# EAGLE design GPS lure (EAGLE 7.6.0)
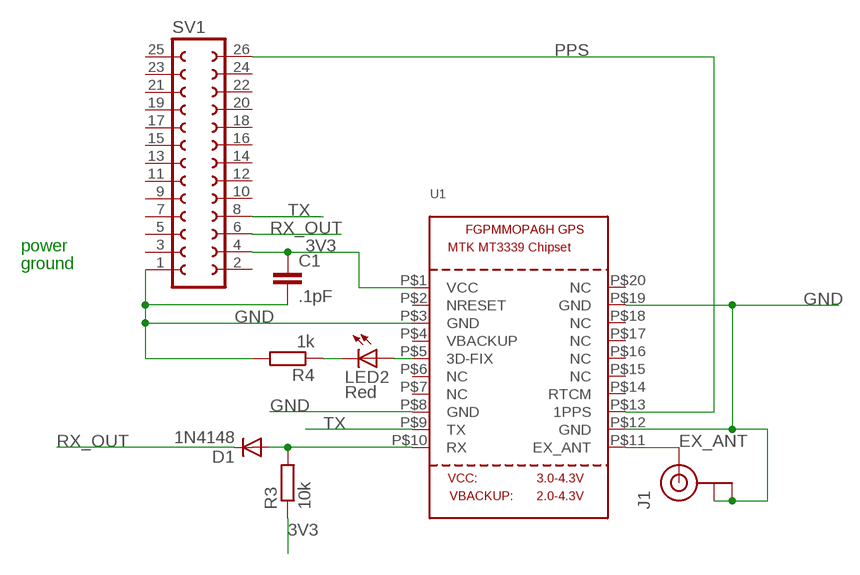
[diagram p0: schematic, sheet 1]

## Parts
C1  .1pF  C-EUC0805  [C0805]
D1  1N4148  DIODE-SOD123  [SOD123]
J1  U.FL  [U.FL]
LED2  Red  LEDCHIPLED_1206  [CHIPLED_1206]
R3  10k  R-EU_M1206  [M1206]
R4  1k  R-EU_M1206  [M1206]
SV1  FE13-2  [FE13-2]
U1  GPS_FGPMMOPA6H  [FGPMMOPA6H]

## Nets
3V3: C1.1 R3.1 SV1.4 U1.P$1(VCC)
EX_ANT: J1.P$3(SIGNAL) U1.P$11(EX_ANT)
GND: C1.2 J1.P$1(GND) J1.P$2(GND) R4.2 SV1.1 U1.P$3(GND) U1.P$8(GND) U1.P$12(GND) U1.P$19(GND)
N$1: LED2.A U1.P$5(3D-FIX)
N$2: LED2.C R4.1
N$4: D1.A R3.2 U1.P$10(RX)
PPS: SV1.26 U1.P$13(1PPS)
RX_OUT: D1.C SV1.6
TX: SV1.8 U1.P$9(TX)
Unconnected: SV1.2 SV1.3 SV1.5 SV1.7 SV1.9 SV1.10 SV1.11 SV1.12 SV1.13 SV1.14 SV1.15 SV1.16 SV1.17 SV1.18 SV1.19 SV1.20 SV1.21 SV1.22 SV1.23 SV1.24 SV1.25 U1.P$2(NRESET) U1.P$4(VBACKUP) U1.P$6(NC) U1.P$7(NC) U1.P$14(RTCM) U1.P$15(NC) U1.P$16(NC) U1.P$17(NC) U1.P$18(NC) U1.P$20(NC)

## Notes on the sheet
- power
- ground

## Library data of the parts
C1 = rcl:C-EU: CAPACITOR, European symbol
D1 = diode:DIODE-: DIODE
J1 = SparkFun-Connectors:U.FL: SMD antenna connector- WRL-09144; PROD_ID: CONN-09193
LED2 = led:LED: LED OSRAM: - CHIPLED LG R971, LG N971, LY N971, LG Q971, LY Q971, LO R971, LY R971 LH N974, LH R974 LS Q976, LO Q976, LY Q976 LO Q996 - Hyper CHIPLED LW Q18S LB Q993, LB Q99A, LB R99A - SideLED LS A670, LO A670, LY A670, LG A670, LP A670 LB A673, LV A673, LT A673, LW A673 LH A674 LY A675 LS A676, LA A676, LO A676, LY A676, LW A676 LS A679, LY A679, LG A679 - Hyper Micro SIDELED® LS Y876, LA Y876, LO Y876, LY Y876 LT Y87S - SmartLED LW L88C, LW L88S LB L89C, LB L89S, LG L890 LS L89K, LO L89K, LY L89K LS L896, LA L896, LO L896, LY L896 - TOPLED LS T670, LO T670, LY T670, LG T670, LP T670 LSG T670, LSP T670, LSY T670, LOP T670, LYG T670 LG T671, LOG T671, LSG T671 LB T673, LV T673, LT T673, LW T673 LH T674 LS T676, LA T676, LO T676, LY T676, LB T676, LH T676, LSB T676, LW T676 LB T67C, LV T67C, LT T67C, LS T67K, LO T67K, LY T67K, LW E67C LS E67B, LA E67B, LO E67B, LY E67B, LB E67C, LV E67C, LT E67C LW T67C LS T679, LY T679, LG T679 LS T770, LO T770, LY T770, LG T770, LP T770 LB T773, LV T773, LT T773, LW T773 LH T774 LS E675, LA E675, LY E675, LS T675 LS T776, LA T776, LO T776, LY T776, LB T776 LHGB T686 LT T68C, LB T68C - Hyper Mini TOPLED® LB M676 - Mini TOPLED Santana® LG M470 LS M47K, LO M47K, LY M47K Source: http://www.osram.convergy.de LUXEON: - LUMILED® LXK2-PW12-R00, LXK2-PW12-S00, LXK2-PW14-U00, LXK2-PW14-V00 LXK2-PM12-R00, LXK2-PM12-S00, LXK2-PM14-U00 LXK2-PE12-Q00, LXK2-PE12-R00, LXK2-PE12-S00, LXK2-PE14-T00, LXK2-PE14-U00 LXK2-PB12-K00, LXK2-PB12-L00, LXK2-PB12-M00, LXK2-PB14-N00, LXK2-PB14-P00, LXK2-PB14-Q00 LXK2-PR12-L00, LXK2-PR12-M00, LXK2-PR14-Q00, LXK2-PR14-R00 LXK2-PD12-Q00, LXK2-PD12-R00, LXK2-PD12-S00 LXK2-PH12-R00, LXK2-PH12-S00 LXK2-PL12-P00, LXK2-PL12-Q00, LXK2-PL12-R00 Source: www.luxeon.com KINGBRIGHT: KA-3528ASYC Source: www.kingbright.com
R3 R4 = rcl:R-EU_: RESISTOR, European symbol
SV1 = con-lsta:FE13-2: FEMALE HEADER; OC_FARNELL: unknown; OC_NEWARK: unknown
U1 = adafruit:GPS_FGPMMOPA6H: GPS Module - MTK MT3339 Chipset, -165dBm sensitivity, 22 channels, 10Hz, auto-select external antenna options

## Board
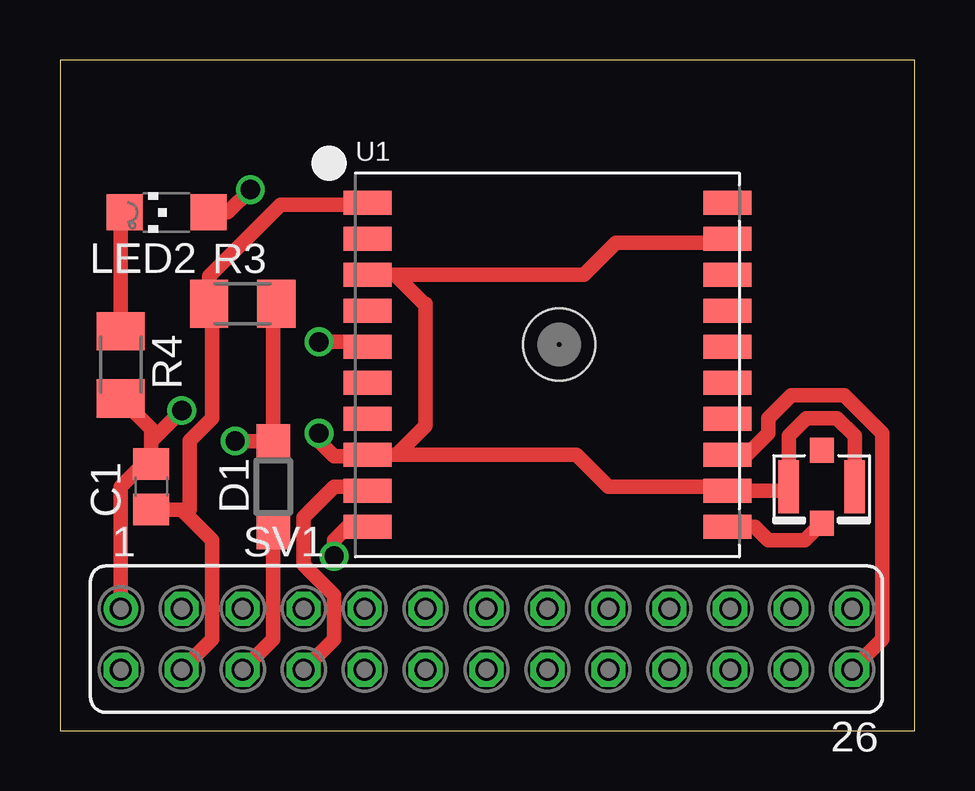
[diagram p1: board, top side]
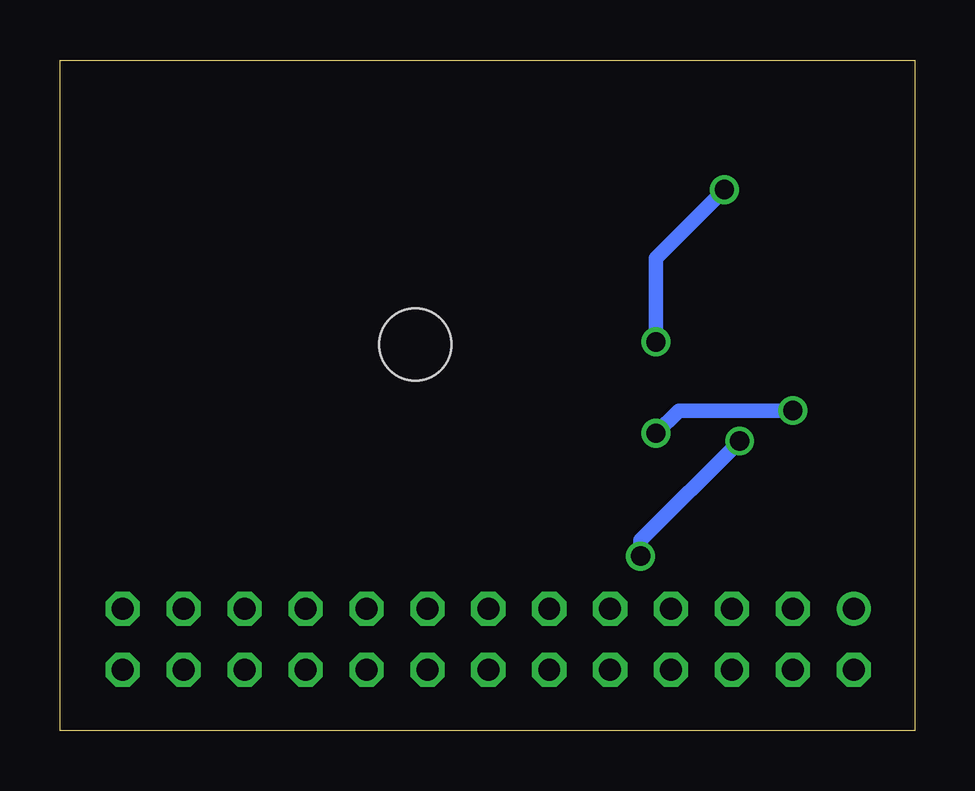
[diagram p2: board, bottom side, seen from below]

Size 35.64 x 27.94 mm. Coordinates in mm from the lower left corner, seen from the top.
Outline: 0,0 35.64,0 35.64,27.94 0,27.94 0,0
Copper layers (1*16): Top 0.035mm / dielectric 1.5mm / Bottom 0.035mm
Design rules "default": minimum track width 10mil, minimum drill 24mil, track to track 8mil, track to pad 8mil, pad to pad 8mil, via to via 8mil, smd to smd 8mil, copper to edge 40mil, drill to drill 8mil, minimum pad ring 10mil, minimum via ring 8mil, stop-mask expansion 4mil, vias tented up to drill 0mil, thermal gap 10mil

### Footprints (pad centres in the part's own frame; a part is rotated, then mirrored left to right if it is on the bottom)
C0805 = smd 1.3 x 1.5: 1 -0.95,0; 2 0.95,0
SOD123 = smd 1.4 x 1.4: A 1.9,0; C -1.9,0
U.FL = smd 2.2 x 0.85: P$1 0,1.375; P$2 0,-1.375 | smd 1.05 x 1: P$3 1.525,0; P$4 -1.525,0
CHIPLED_1206 = smd 1.5 x 1.5: A 0,-1.75; C 0,1.75
M1206 = smd 1.6 x 2: 1 -1.4,0; 2 1.4,0
FE13-2 = drill 0.914: 1 -15.24,1.27 | drill 0.914 octagon: 2 -15.24,-1.27; 3 -12.7,1.27; 4 -12.7,-1.27; 5 -10.16,1.27; 6 -10.16,-1.27; 7 -7.62,1.27; 8 -7.62,-1.27; 9 -5.08,1.27; 10 -5.08,-1.27; 11 -2.54,1.27; 12 -2.54,-1.27; 13 0,1.27; 14 0,-1.27; 15 2.54,1.27; 16 2.54,-1.27; 17 5.08,1.27; 18 5.08,-1.27; 19 7.62,1.27; 20 7.62,-1.27; 21 10.16,1.27; 22 10.16,-1.27; 23 12.7,1.27; 24 12.7,-1.27; 25 15.24,1.27; 26 15.24,-1.27
FGPMMOPA6H = smd 2 x 1: P$1 -7.5,6.75; P$2 -7.5,5.25; P$3 -7.5,3.75; P$4 -7.5,2.25; P$5 -7.5,0.75; P$6 -7.5,-0.75; P$7 -7.5,-2.25; P$8 -7.5,-3.75; P$9 -7.5,-5.25; P$10 -7.5,-6.75; P$11 7.5,-6.75; P$12 7.5,-5.25; P$13 7.5,-3.75; P$14 7.5,-2.25; P$15 7.5,-0.75; P$16 7.5,0.75; P$17 7.5,2.25; P$18 7.5,3.75; P$19 7.5,5.25; P$20 7.5,6.75 | hole 3: 0.5,0.85

### Placement (x,y rotation side)
C1  3.81,10.16 90 top
D1  8.89,10.16 90 top
J1  31.75,10.16 270 top
LED2  4.45,21.59 90 top
R3  7.62,17.78 0 top
R4  2.54,15.24 270 top
SV1  17.78,3.81 0 top
U1  20.32,15.24 0 top

### Tracks (layer width: path | path; a pad name or v marks a point on that pad's centre or on a via)
3V3
  Top 0.61: U1.P$1 12.74,21.91 9.21,21.91 6.22,18.92 R3.1 6.35,17.65 6.35,13.02 5.4,12.07 5.4,9.21 5.08,9.21 | C1.1 5.08,9.21 | 5.08,9.21 6.35,7.94 6.35,3.81 SV1.4
EX_ANT
  Top 0.61: U1.P$11 28.98,8.49 29.53,7.94 31.05,7.94 J1.P$3
GND  (via drill 0.8)
  Top 0.61: 3.5,10.79 C1.2 | C1.2 3.81,12.57 R4.2 | U1.P$3 13.97,18.99 | 13.97,18.99 21.85,18.99 23.18,20.32 27.65,20.32 U1.P$19 | U1.P$8 21.53,11.49 22.86,10.16 27.65,10.16 U1.P$12 30.2,9.99 J1.P$2 30.38,12.28 31.11,13.02 32.38,13.02 33.12,12.28 J1.P$1 | U1.P$8 14.03,11.49 15.24,12.7 15.24,17.78 15.18,17.78 13.97,18.99 | C1.2 3.81,12.06 v5.08,13.34 | v10.79,12.38 10.79,12.06 11.43,11.43 12.76,11.43 U1.P$8 | SV1.1 2.54,10.16 3.49,11.11 C1.2
  Bottom 0.61: v5.08,13.34 9.84,13.34 v10.79,12.38
N$1  (via drill 0.8)
  Top 0.61: LED2.A 6.99,21.59 v7.94,22.54 | v10.79,16.19 12.62,16.19 U1.P$5
  Bottom 0.61: v7.94,22.54 10.79,19.68 v10.79,16.19
N$2
  Top 0.61: R4.1 2.54,21.43 LED2.C
N$4  (via drill 0.8)
  Top 0.61: R3.2 8.89,17.65 D1.A v7.3,12.06 | U1.P$10 11.98,8.49 11.43,7.94 v11.43,7.27
  Bottom 0.61: v11.43,7.27 11.43,7.94 v7.3,12.06
PPS
  Top 0.61: U1.P$13 28.64,11.49 29.53,12.38 29.53,13.02 30.48,13.97 32.7,13.97 34.29,12.38 34.29,3.81 SV1.26
RX_OUT
  Top 0.61: D1.C 8.89,3.81 SV1.6
TX
  Top 0.61: U1.P$9 12.65,10.16 11.43,10.16 10.16,8.89 10.16,6.91 11.43,5.64 11.43,3.81 SV1.8